# Altium schematic sheet monitoring_board.SchDoc
size A3
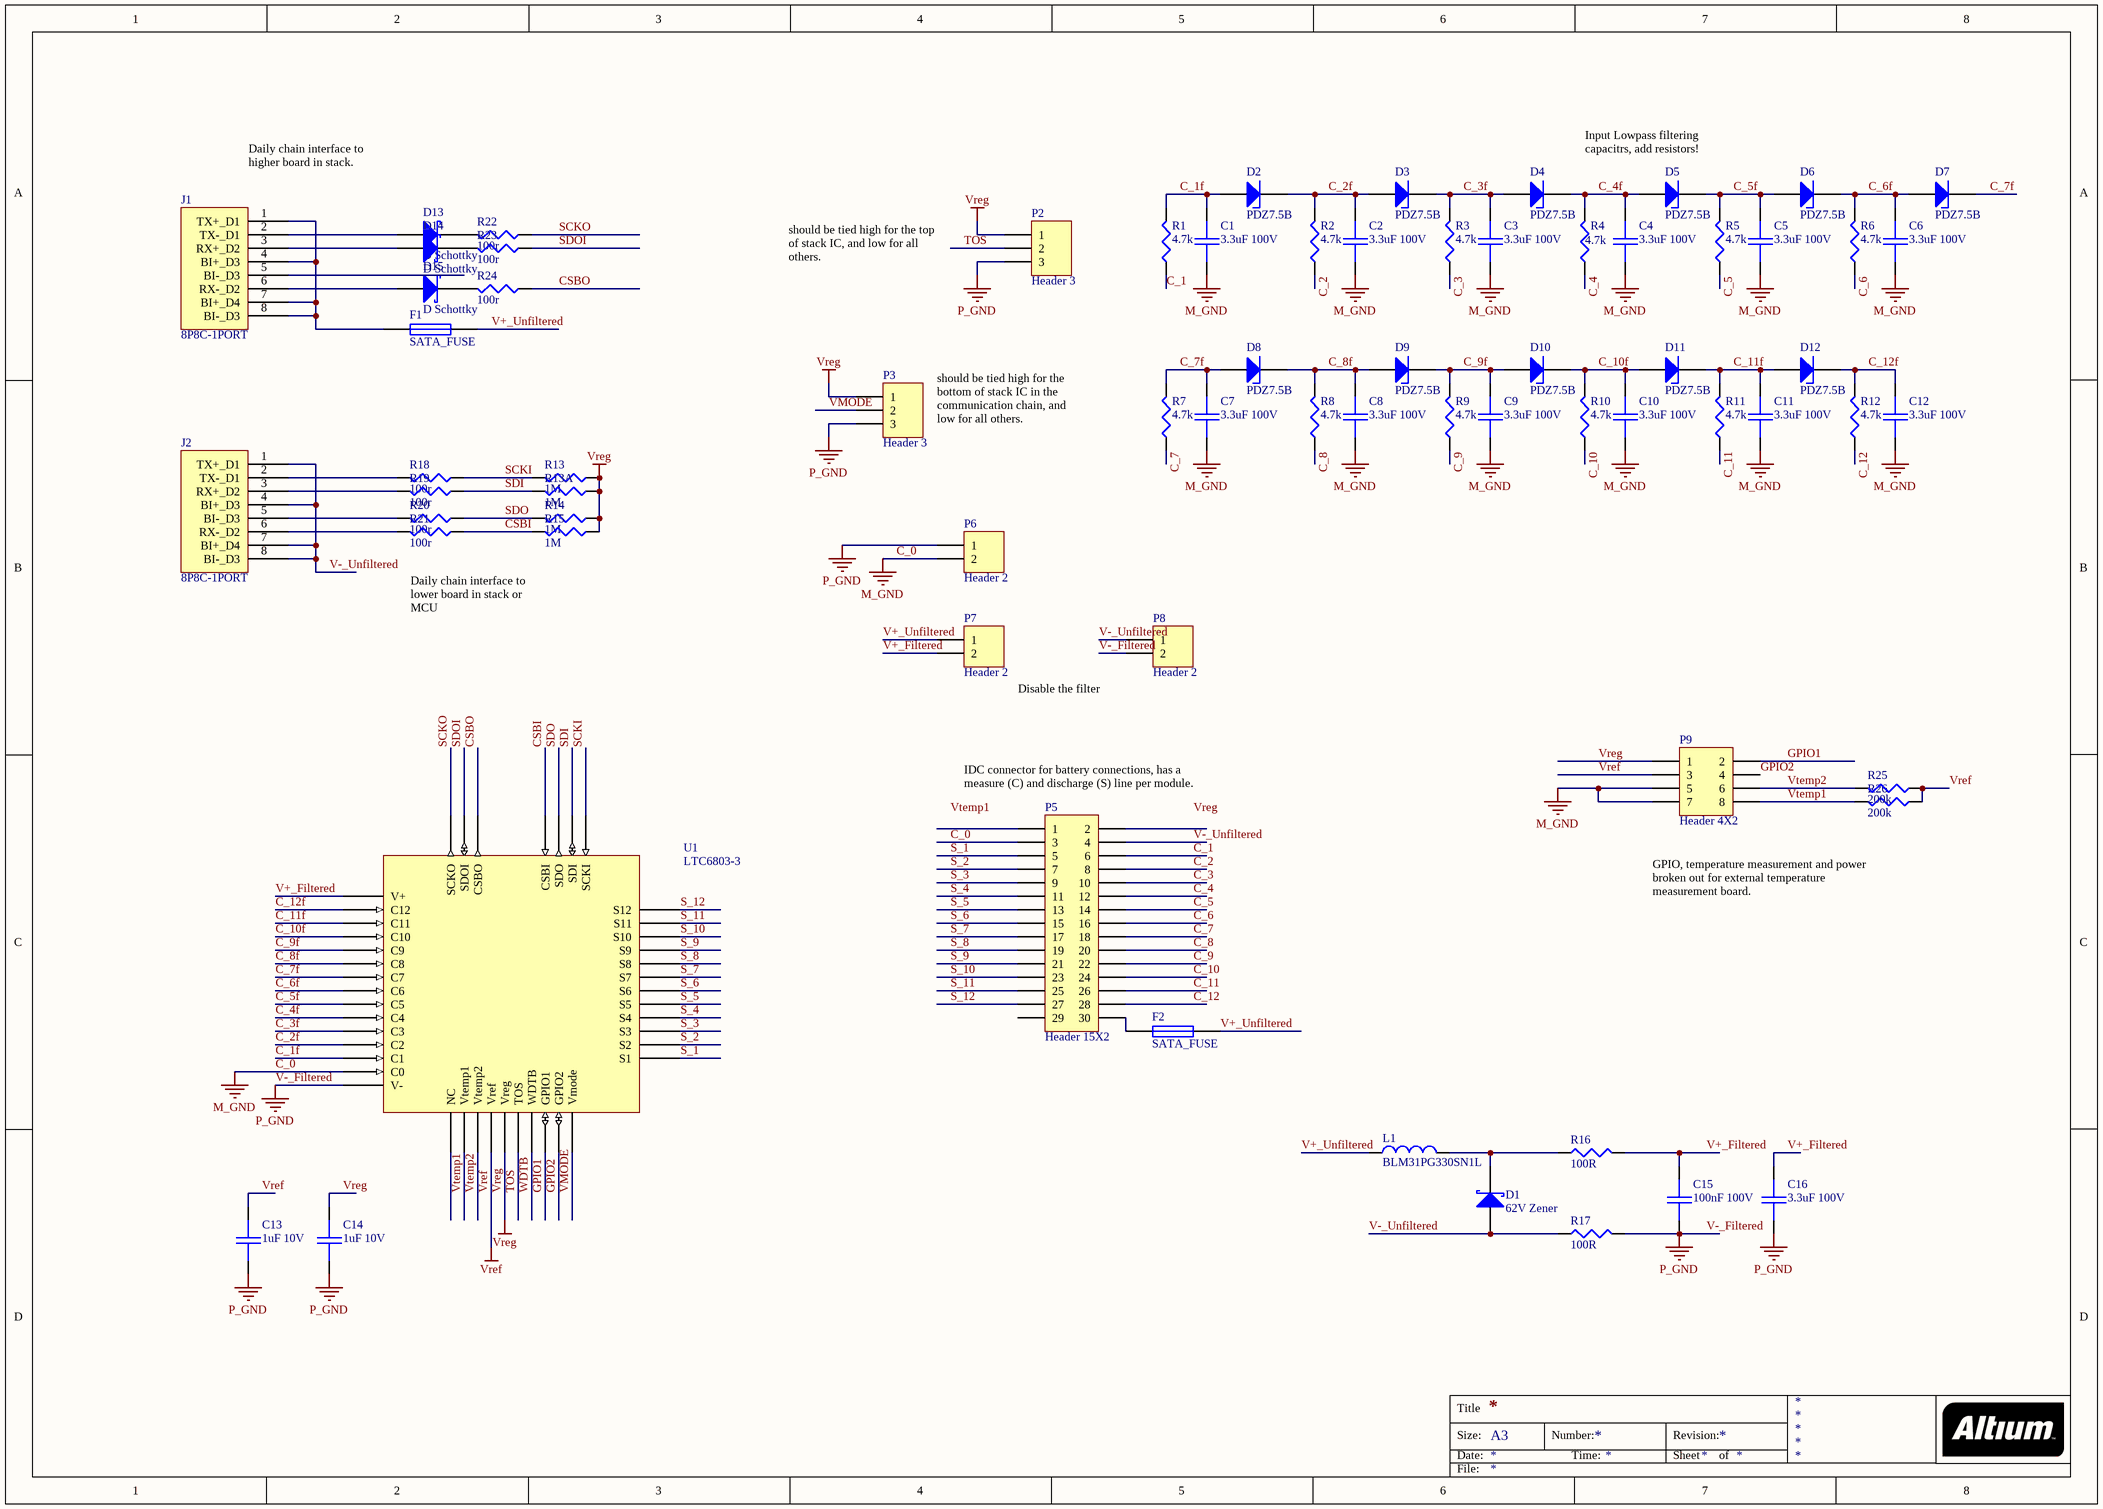
[diagram p0: monitoring_board.SchDoc]

## Parts
C1  3.3uF 100V  [1206]
C2  3.3uF 100V  [1206]
C3  3.3uF 100V  [1206]
C4  3.3uF 100V  [1206]
C5  3.3uF 100V  [1206]
C6  3.3uF 100V  [1206]
C7  3.3uF 100V  [1206]
C8  3.3uF 100V  [1206]
C9  3.3uF 100V  [1206]
C10  3.3uF 100V  [1206]
C11  3.3uF 100V  [1206]
C12  3.3uF 100V  [1206]
C13  1uF 10V  [0603]
C14  1uF 10V  [0603]
C15  100nF 100V  [1206]
C16  3.3uF 100V  [1206]
D1  62V Zener  [DO-214AA]
D2  PDZ7.5B  [SOD323]
D3  PDZ7.5B  [SOD323]
D4  PDZ7.5B  [SOD323]
D5  PDZ7.5B  [SOD323]
D6  PDZ7.5B  [SOD323]
D7  PDZ7.5B  [SOD323]
D8  PDZ7.5B  [SOD323]
D9  PDZ7.5B  [SOD323]
D10  PDZ7.5B  [SOD323]
D11  PDZ7.5B  [SOD323]
D12  PDZ7.5B  [SOD323]
D13  D Schottky  [SMB]
D14  D Schottky  [SMB]
D15  D Schottky  [SMB]
F1  SATA_FUSE  [RESC3225M_1210I]
F2  SATA_FUSE  [LITTELFUSE-154]
J1  8P8C-1PORT  [8P8C-1PORT]
J2  8P8C-1PORT  [8P8C-1PORT]
L1  BLM31PG330SN1L  [1206]
P2  Header 3  [HDR1X3]
P3  Header 3  [HDR1X3]
P5  Header 15X2  [HDR2X15]
P6  Header 2  [HDR1X2]
P7  Header 2  [HDR1X2]
P8  Header 2  [HDR1X2]
P9  Header 4X2  [HDR2X4]
R1  4.7k  [1206]
R2  4.7k  [1206]
R3  4.7k  [1206]
R4  4.7k  [1206]
R5  4.7k  [1206]
R6  4.7k  [1206]
R7  4.7k  [1206]
R8  4.7k  [1206]
R9  4.7k  [1206]
R10  4.7k  [1206]
R11  4.7k  [1206]
R12  4.7k  [1206]
R13  1M  [0603]
R13A  1M  [0603]
R14  1M  [0603]
R15  1M  [0603]
R16  100R  [1206]
R17  100R  [1206]
R18  100r  [0603]
R19  100r  [0603]
R20  100r  [0603]
R21  100r  [0603]
R22  100r  [0603]
R23  100r  [0603]
R24  100r  [0603]
R25  200k  [0603]
R26  200k  [0603]
U1  LTC6803-3  [SOP44]

## Nets
C_0: C1.2 C2.2 C3.2 C4.2 C5.2 C6.2 C7.2 C8.2 C9.2 C10.2 C11.2 C12.2 P5.3 P6.2 P9.5 P9.7 U1.29(C0)  [also labelled M_GND]
V-_Filtered: C13.2 C14.2 C15.2 C16.2 P2.3 P3.3 P6.1 P8.2 R17.2 U1.30(V-)  [also labelled P_GND]
Vref: C13.1 P9.3 R25.1 R26.1 U1.34(Vref)
Vreg: C14.1 P2.1 P3.1 P9.1 R13.1 R13A.1 R14.1 R15.1 U1.35(Vreg)
C_1: P5.6 R1.1
C_1f: C1.1 D2.A R1.2 U1.27(C1)
C_2: P5.8 R2.1
C_2f: C2.1 D2.K D3.A R2.2 U1.25(C2)
C_3: P5.10 R3.1
C_3f: C3.1 D3.K D4.A R3.2 U1.23(C3)
C_4: P5.12 R4.1
C_4f: C4.1 D4.K D5.A R4.2 U1.21(C4)
C_5: P5.14 R5.1
C_5f: C5.1 D5.K D6.A R5.2 U1.19(C5)
C_6: P5.16 R6.1
C_6f: C6.1 D6.K D7.A R6.2 U1.17(C6)
C_7: P5.18 R7.1
C_7f: C7.1 D7.K D8.A R7.2 U1.15(C7)
C_8: P5.20 R8.1
C_8f: C8.1 D8.K D9.A R8.2 U1.13(C8)
C_9: P5.22 R9.1
C_9f: C9.1 D9.K D10.A R9.2 U1.11(C9)
C_10: P5.24 R10.1
C_10f: C10.1 D10.K D11.A R10.2 U1.9(C10)
C_11: P5.26 R11.1
C_11f: C11.1 D11.K D12.A R11.2 U1.7(C11)
C_12: P5.28 R12.1
C_12f: C12.1 D12.K R12.2 U1.5(C12)
CSBI: R15.2 R21.1 U1.44(CSBI)
CSBO: R24.2 U1.1(CSBO)
GPIO1: P9.2 U1.38(GPIO1)
GPIO2: P9.4 U1.39(GPIO2)
S_1: P5.5 U1.28(S1)
S_2: P5.7 U1.26(S2)
S_3: P5.9 U1.24(S3)
S_4: P5.11 U1.22(S4)
S_5: P5.13 U1.20(S5)
S_6: P5.15 U1.18(S6)
S_7: P5.17 U1.16(S7)
S_8: P5.19 U1.14(S8)
S_9: P5.21 U1.12(S9)
S_10: P5.23 U1.10(S10)
S_11: P5.25 U1.8(S11)
S_12: P5.27 U1.6(S12)
SCKI: R13.2 R18.1 U1.41(SCKI)
SCKO: R22.2 U1.3(SCKO)
SDI: R13A.2 R19.1 U1.42(SDI)
SDO: R14.2 R20.1 U1.43(SDO)
SDOI: R23.2 U1.2(SDOI)
TOS: P2.2 U1.36(TOS)
V+_Filtered: C15.1 C16.1 P7.2 R16.2 U1.4(V+)
V+_Unfiltered: F1.1 F2.1 L1.1 P7.1
V-_Unfiltered: D1.1(A) J2.1(TX+_D1) J2.4(BI+_D3) J2.7(BI+_D4) J2.8(BI-_D3) P5.4 P8.1 R17.1
VMODE: P3.2 U1.40(Vmode)
Vtemp1: P9.8 R26.2 U1.32(Vtemp1)
Vtemp2: P9.6 R25.2 U1.33(Vtemp2)
WDTB: U1.37(WDTB)
NetD1_2: D1.2(K) L1.2 R16.1
NetD13_1: D13.1(A) J1.2(TX-_D1)
NetD13_2: D13.2(K) R22.1
NetD14_1: D14.1(A) J1.3(RX+_D2)
NetD14_2: D14.2(K) R23.1
NetD15_1: D15.1(A) J1.6(RX-_D2)
NetD15_2: D15.2(K) R24.1
NetF1_2: F1.2 J1.1(TX+_D1) J1.4(BI+_D3) J1.7(BI+_D4) J1.8(BI-_D3)
NetF2_2: F2.2 P5.30
NetJ2_2: J2.2(TX-_D1) R18.2
NetJ2_3: J2.3(RX+_D2) R19.2
NetJ2_5: J2.5(BI-_D3) R20.2
NetJ2_6: J2.6(RX-_D2) R21.2

Not connected (* = marked no-connect by the designer): J1 5(BI-_D3); P5 1 2 29; U1 31(NC)

## Notes on the sheet
- Input Lowpass filtering capacitrs, add resistors!
- (near J1) Daily chain interface to higher board in stack.
- should be tied high for the top of stack IC, and low for all others.
- should be tied high for the bottom of stack IC in the communication chain, and low for all others.
- Daily chain interface to lower board in stack or MCU
- Disable the filter
- (near P5) IDC connector for battery connections, has a measure (C) and discharge (S) line per module.
- GPIO, temperature measurement and power broken out for external temperature measurement board.
- Labels drawn without touching a wire or pin: Vreg, Vtemp1
- Title
- Size:
- Date:
- A3
- Number:
- Time:
- Revision:
- Sheet
- of
- File:

## Library data of the parts
C1-C16 = CAP: Capacitor
D1 = D Schottky: SMBJ64CABCT-ND; Published: 8-Jun-2000; LatestRevisionDate: 17-Jul-2002; LatestRevisionNote: Re-released for DXP Platform.; PackageReference: SMB; Publisher: Altium Limited; PackageDescription: DO-214-AA/SMB; 2 C-Bend Leads; Body 5.3 x 3.6 mm, inc. leads (LxW); Code_JEDEC: DO-214-AA
D2-D12 = ZENER1: Zener Diode
D13-D15 = D Schottky: Schottky Diode; Published: 8-Jun-2000; LatestRevisionDate: 17-Jul-2002; LatestRevisionNote: Re-released for DXP Platform.; PackageReference: SMB; Publisher: Altium Limited; PackageDescription: DO-214-AA/SMB; 2 C-Bend Leads; Body 5.3 x 3.6 mm, inc. leads (LxW); Code_JEDEC: DO-214-AA
F1 F2 = FUSE
L1 = INDUCTOR: Manufacturer: Generic Components; Class I: Passive; Value: Ferrite; Published: 8-Jun-2000; Revision: July-2002: Re-released for DXP Platform.; Publisher: Altium Limited; Class II: Inductor
P2 P3 = Header 3: Header, 3-Pin; LatestRevisionDate: 17-Jul-2002; LatestRevisionNote: Re-released for DXP Platform.; Publisher: Altium Limited
P5 = Header 15X2: Header, 15-Pin, Dual row; LatestRevisionDate: 17-Jul-2002; LatestRevisionNote: Re-released for DXP Platform.; Publisher: Altium Limited
P6-P8 = Header 2: Header, 2-Pin; LatestRevisionDate: 17-Jul-2002; LatestRevisionNote: Re-released for DXP Platform.; Publisher: Altium Limited
P9 = Header 4X2: Header, 4-Pin, Dual row; LatestRevisionDate: 17-Jul-2002; LatestRevisionNote: Re-released for DXP Platform.; Publisher: Altium Limited
R1-R13 R13A R14-R26 = RES1: Resistor